# EAGLE design repater_i2c (EAGLE 8.2.2)
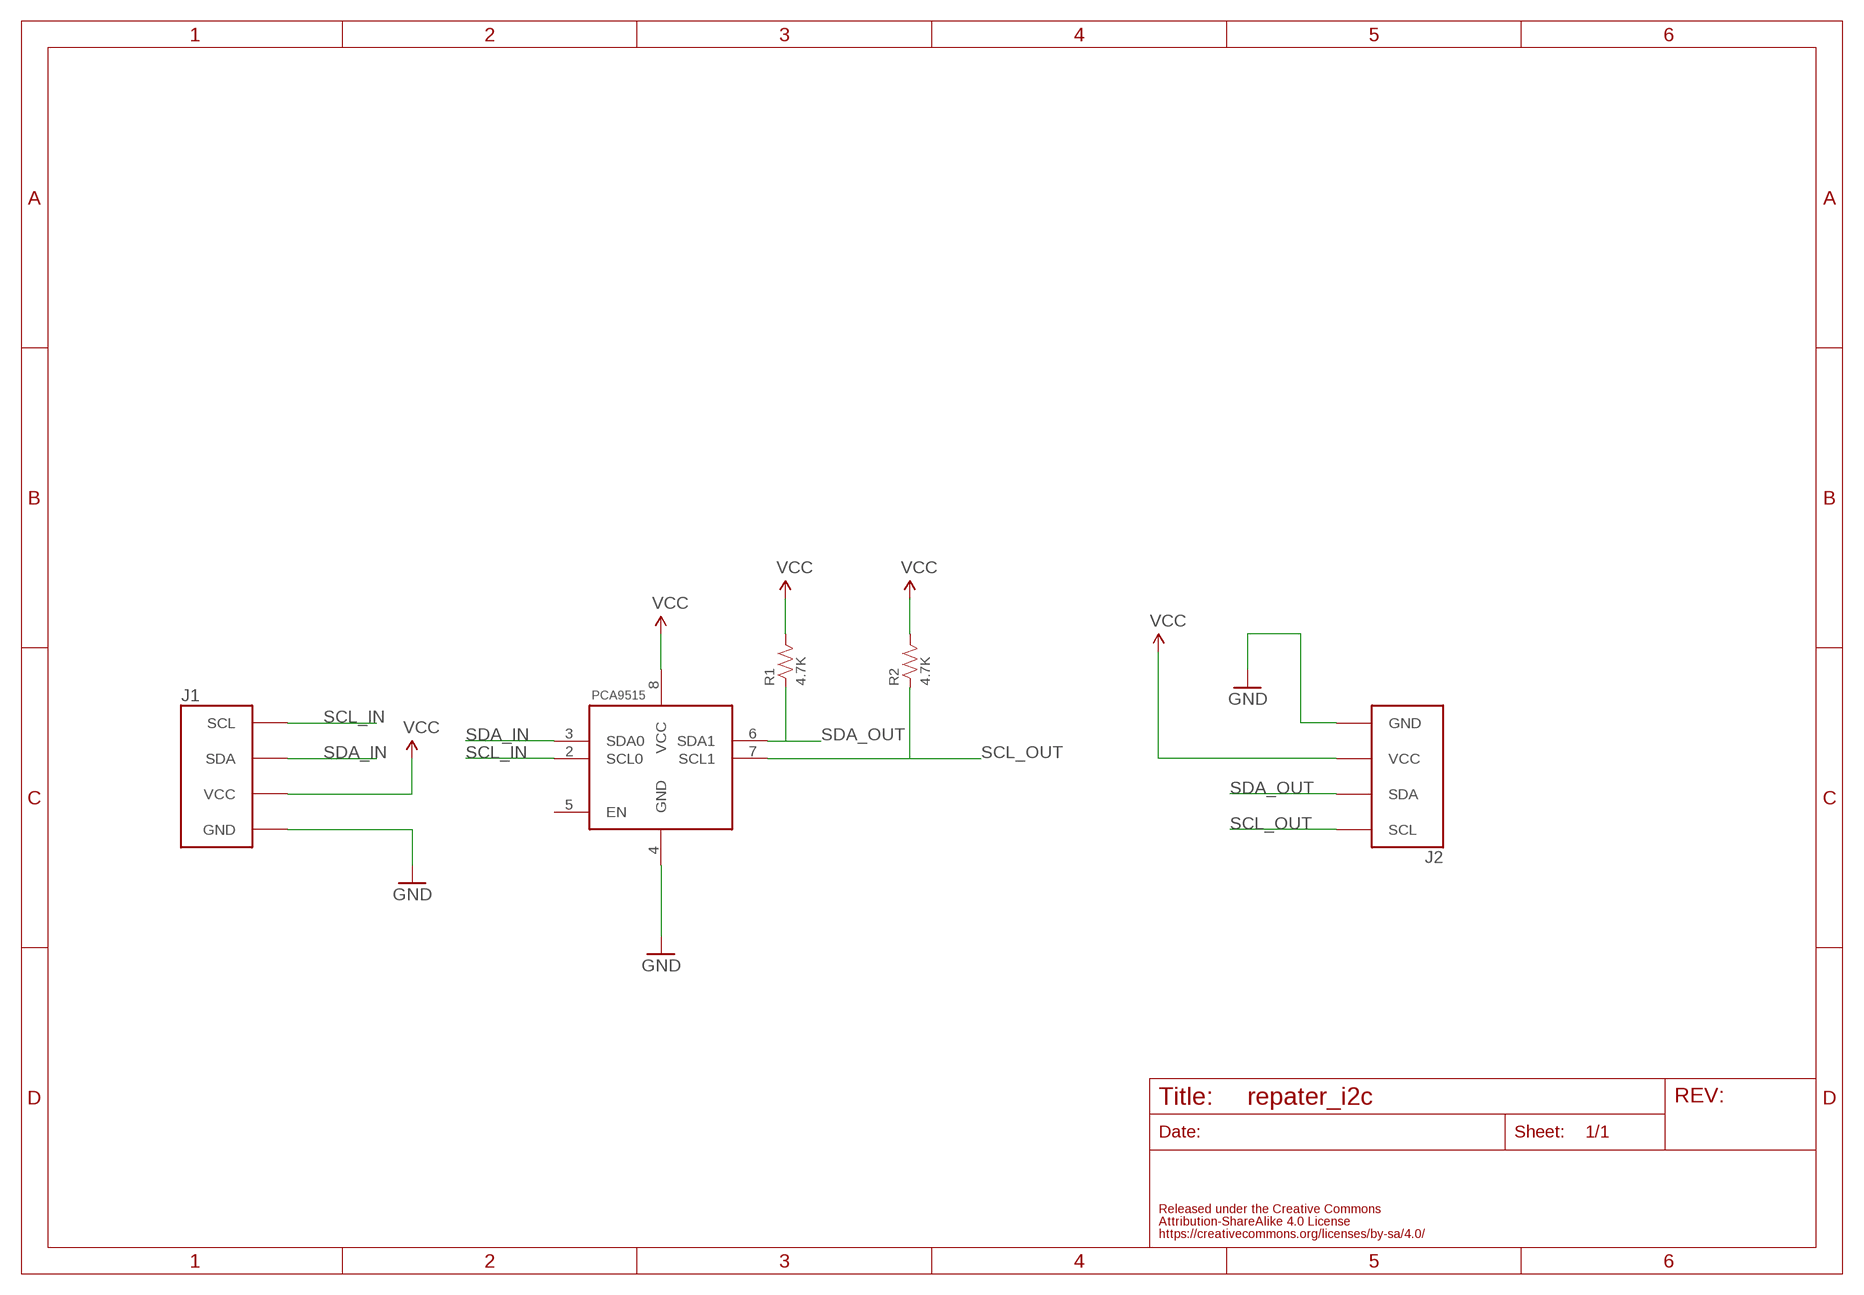
[diagram p0: schematic, sheet 1]

## Parts
J1  FABO_BRICK_I2C-S04B-PASK-2_LONG  [FABO_BRICK_I2C_S04B-PASK-2_LONG]
J2  FABO_BRICK_I2C-S04B-PASK-2_LONG  [FABO_BRICK_I2C_S04B-PASK-2_LONG]
PCA9515  PCA9515  [SO8]
R1  4.7K  RESISTOR-0603  [0603]
R2  4.7K  RESISTOR-0603  [0603]

## Nets
GND: J1.GND J2.GND PCA9515.4(GND)
SCL_IN: J1.SCL PCA9515.2(SCL0)
SCL_OUT: J2.SCL PCA9515.7(SCL1) R2.1
SDA_IN: J1.SDA PCA9515.3(SDA0)
SDA_OUT: J2.SDA PCA9515.6(SDA1) R1.1
VCC: J1.VCC J2.VCC PCA9515.8(VCC) R1.2 R2.2
Unconnected: PCA9515.5(EN)

## Library data of the parts
J1 J2 = FaBo-Template:FABO_BRICK_I2C: FaBo Brick I2C
PCA9515 = FaBo-Repeater:PCA9515
R1 R2 = FaBo-Resistors:RESISTOR: RESISTOR

## Board
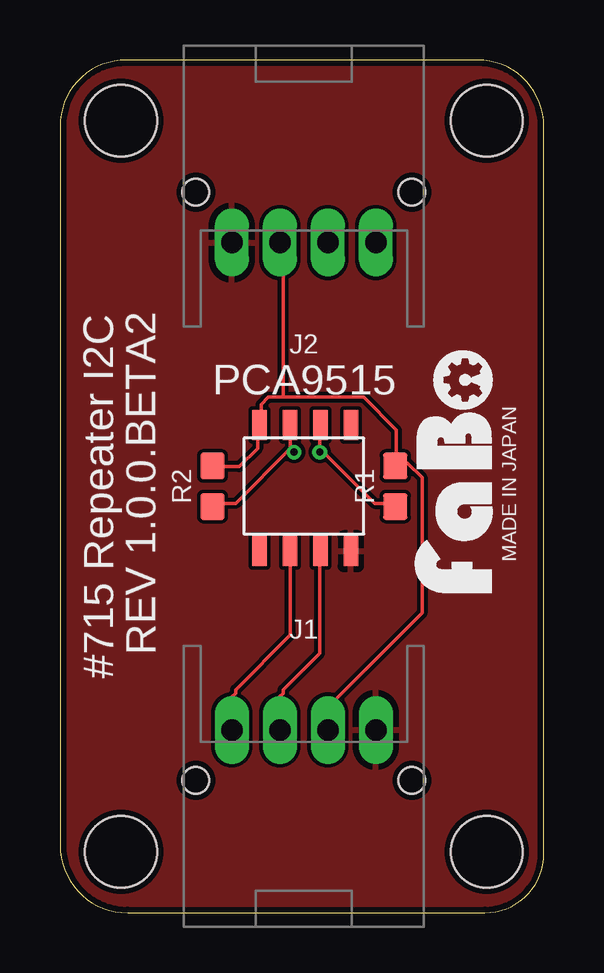
[diagram p1: board, top side]
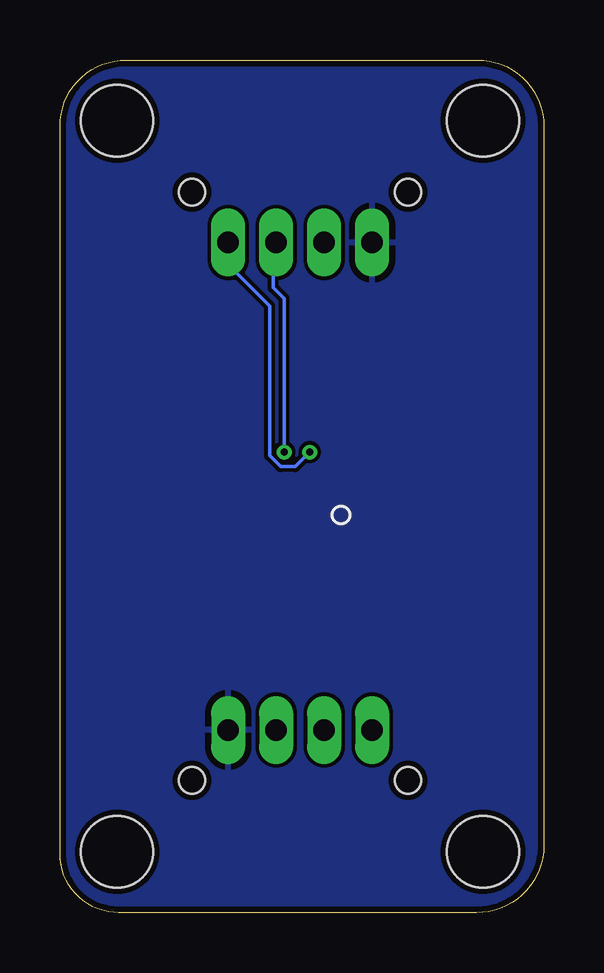
[diagram p2: board, bottom side, seen from below]

Size 20.16 x 35.55 mm. Coordinates in mm from the lower left corner, seen from the top.
Outline: 0,32.78 0,2.81 arc90 2.81,0 17.71,0 arc90 20.16,2.46 20.16,32.78 arc90 17.39,35.55 2.77,35.55 arc90 0,32.78
Copper layers (1*16): Top 0.035mm / dielectric 1.5mm / Bottom 0.035mm
Design rules "SeeedStudio_2layer_DRU_no_angle_20140221": minimum track width 6mil, minimum drill 12mil, track to track 6mil, track to pad 6mil, pad to pad 6mil, via to via 6mil, smd to smd 0mil, copper to edge 10mil, drill to drill 10mil, minimum pad ring 10mil, minimum via ring 6mil, stop-mask expansion 2mil, vias tented up to drill 100mil, thermal gap 10mil
Holes 3 mm at 2.54,33.02 17.78,33.02 2.54,2.54 17.78,2.54

### Footprints (pad centres in the part's own frame; a part is rotated, then mirrored left to right if it is on the bottom)
FABO_BRICK_I2C_S04B-PASK-2_LONG = drill 0.9 pad 1.422 long: GND -3,0; SCL 3,0; SDA 1,0; VCC -1,0 | hole 1.1: 4.5,2.1; -4.5,2.1
SO8 = smd 0.6 x 1.25: 1 -1.85,-2.7; 2 -0.58,-2.7; 3 0.69,-2.7; 4 1.96,-2.7; 5 1.96,2.55; 6 0.69,2.55; 7 -0.58,2.55; 8 -1.85,2.55
0603 = smd 1.1 x 1: 1 -0.85,0; 2 0.85,0

### Placement (x,y rotation side)
J1  10.16,7.62 180 top
J2  10.16,27.94 0 top
PCA9515  10.16,17.78 0 top
R1  13.97,17.78 90 top
R2  6.35,17.78 90 top
U$2  [LOGO_FABO_MS]  18.4,18.4 90 top

### Tracks (layer width: path | path; a pad name or v marks a point on that pad's centre or on a via)
GND
  pour Bottom: 0,0 20.32,0 20.32,35.56 0,35.56
  pour Top: 0,0 20.32,0 20.32,35.56 0,35.56
SCL_IN
  Top 0.152: PCA9515.2 9.6,14.94 9.6,11.58 7.32,9.3 7.32,9.14 7.16,8.99 J1.SCL
SCL_OUT  (via drill 0.3)
  Top 0.152: 9.6,19.36 7.32,17.07 6.4,17.07 R2.1 | 9.6,19.36 9.6,20.27 PCA9515.7 | 9.6,19.36 v9.75,19.2
  Bottom 0.152: v9.75,19.2 10.36,18.59 10.97,18.59 11.43,19.05 11.43,25.3 13.11,26.98 13.11,27.89 J2.SCL
SDA_IN
  Top 0.152: PCA9515.3 10.82,14.94 10.82,10.82 9.3,9.3 9.3,9.14 9.14,8.99 9.14,7.62 J1.SDA
SDA_OUT  (via drill 0.3)
  Top 0.152: 10.82,19.36 13.11,17.07 13.87,17.07 R1.1 | 10.82,19.36 10.82,20.27 PCA9515.6 | 10.82,19.36 v10.82,19.2
  Bottom 0.152: v10.82,19.2 10.82,25.6 11.28,26.06 11.28,27.89 J2.SDA
VCC
  Top 0.152: R2.2 6.4,18.59 7.47,18.59 8.23,19.36 8.23,20.27 PCA9515.8 8.38,20.42 8.38,21.18 8.69,21.49 9.3,21.49 | 14.02,18.75 14.02,20.12 12.65,21.49 9.3,21.49 | 14.02,18.75 14.48,18.75 15.09,18.14 15.09,12.5 11.28,8.69 11.28,7.62 J1.VCC | 14.02,18.75 R1.2 | 9.3,21.49 9.3,27.89 J2.VCC

### Text on the board
tPlace: #715 Repeater I2C | REV 1.0.0.BETA2 | MADE IN JAPAN